# EAGLE design BradLightFlash.rev1 (EAGLE 6.5.0)
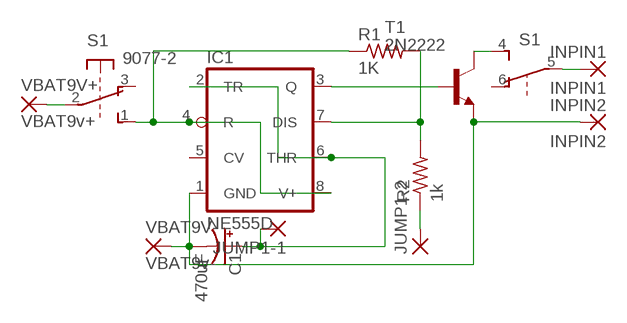
[diagram p0: schematic, sheet 1]

## Parts
C1  470uF  CPOL-USE2.5-6  [E2,5-6]
IC1  NE555D  [SO08]
INPIN1  INPIN1  2,54/1,1  [2,54/1,1]
INPIN2  INPIN2  2,54/1,1  [2,54/1,1]
JUMP1-1  2,54/1,0  [2,54/1,0]
JUMP1-2  2,54/1,0  [2,54/1,0]
R1  1K  R-US_0309/V  [0309V]
R2  1k  R-US_0309/V  [0309V]
S1  9077-2  [9077-2]
T1  2N2222  [TO92-EBC-OVAL]
VBAT9V+  VBAT9v+  2,54/1,1  [2,54/1,1]
VBAT9V-  VBAT9v-  2,54/1,1  [2,54/1,1]

## Nets
N$1: S1.2(1:P) VBAT9V+.1(P)
N$2: IC1.4(R) IC1.8(V+) R1.1 S1.1(1:S)
N$3: C1.- IC1.1(GND) INPIN2.1(P) T1.E VBAT9V-.1(P)
N$4: C1.+ IC1.2(TR) IC1.6(THR) JUMP1-1.1(P)
N$5: JUMP1-2.1(P) R2.1
N$6: IC1.7(DIS) R1.2 R2.2
N$7: IC1.3(Q) T1.B
N$8: S1.4(2:S) T1.C
N$10: INPIN1.1(P) S1.5(2:P)
Unconnected: IC1.5(CV) S1.3(1:O) S1.6(2:O)

## Library data of the parts
C1 = adafruit:CPOL-US: POLARIZED CAPACITOR, American symbol
IC1 = adafruit:*555: TIMER Changed DIP package to have round (not oval) pin pads http://www.ladyada.net/library/pcb/eaglelibrary.html
INPIN1 INPIN2 VBAT9V+ VBAT9V- = wirepad:2,54/1,1: THROUGH-HOLE PAD
JUMP1-1 JUMP1-2 = wirepad:2,54/1,0: THROUGH-HOLE PAD
R1 R2 = adafruit:R-US_: RESISTOR, American symbol
S1 = switch-misc:9077-2: MARQUARDT SWITCH 9077.0200 Distributor: Buerklin <https://www.buerklin.com/default.asp?event=ShowArtikel%2812G2822%29&l=d&jump=ArtNr_12G2822>
T1 = adafruit:2N2222: NPN TRANSISTOR Big oval pads

## Board
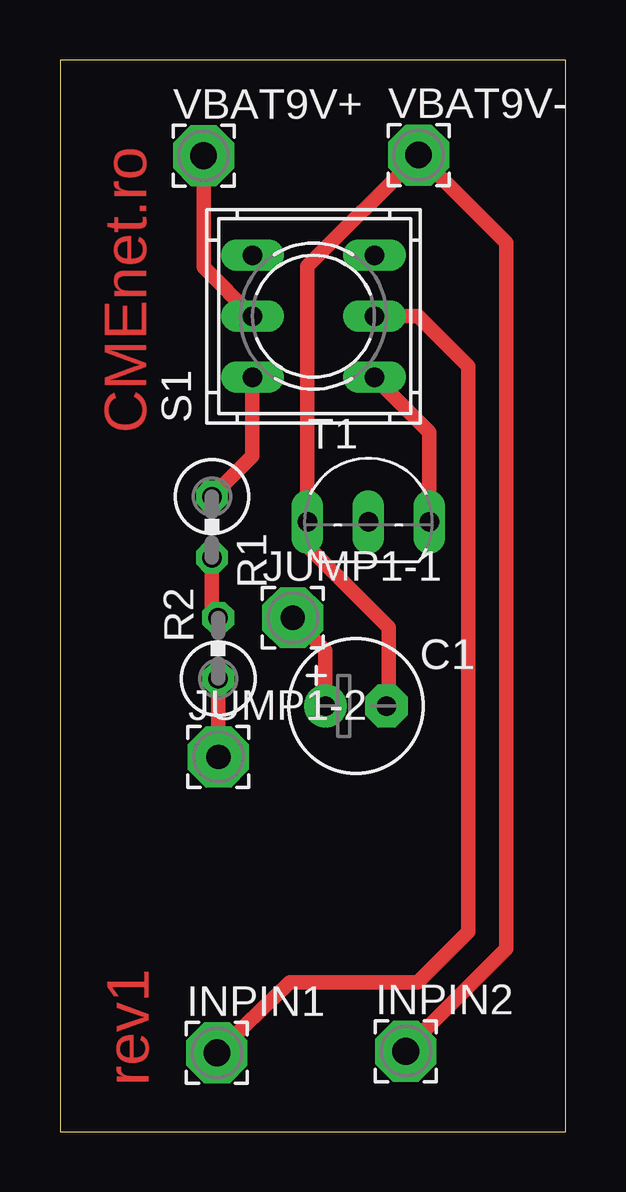
[diagram p1: board, top side]
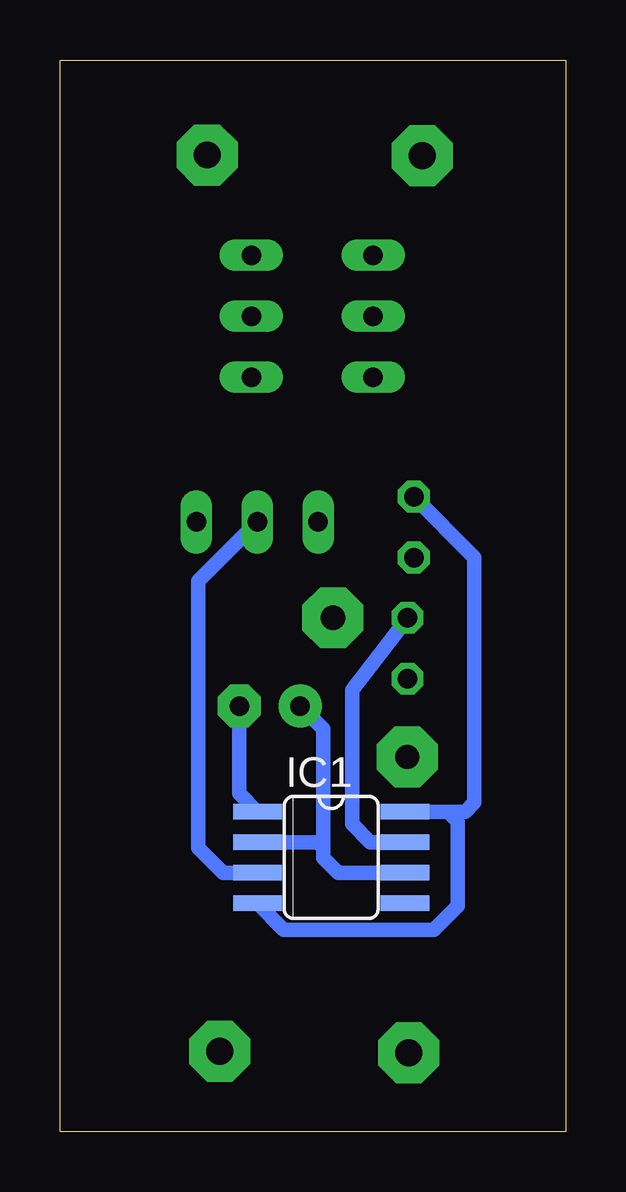
[diagram p2: board, bottom side, seen from below]

Size 21.07 x 44.68 mm. Coordinates in mm from the lower left corner, seen from the top.
Outline: 0,0 21.07,0 21.07,44.68 0,44.68 0,0
Copper layers (1*16): Top 0.035mm / dielectric 1.5mm / Bottom 0.035mm
Design rules "default": minimum track width 10mil, minimum drill 24mil, track to track 8mil, track to pad 8mil, pad to pad 8mil, via to via 8mil, smd to smd 8mil, copper to edge 40mil, drill to drill 8mil, minimum pad ring 10mil, minimum via ring 8mil, stop-mask expansion 4mil, vias tented up to drill 0mil, thermal gap 10mil

### Footprints (pad centres in the part's own frame; a part is rotated, then mirrored left to right if it is on the bottom)
E2,5-6 = drill 0.813 pad 1.778: + -1.27,0 | drill 0.813 pad 1.778 octagon: - 1.27,0
SO08 = smd 0.66 x 2.032: 1 -1.905,-3.073; 2 -0.635,-3.073; 3 0.635,-3.073; 4 1.905,-3.073; 5 1.905,3.073; 6 0.635,3.073; 7 -0.635,3.073; 8 -1.905,3.073
2,54/1,1 = drill 1.118 pad 2.54 octagon: 1 0,0
2,54/1,0 = drill 1.016 pad 2.54 octagon: 1 0,0
0309V = drill 0.813 octagon: 1 -1.27,0; 2 1.27,0
9077-2 = drill 0.813 long: 1 -2.54,2.54; 2 0,2.54; 3 2.54,2.54; 4 -2.54,-2.54; 5 0,-2.54; 6 2.54,-2.54
TO92-EBC-OVAL = drill 0.813 long: B 0,-1.27; C 2.54,-1.27; E -2.54,-1.27

### Placement (x,y rotation side)
C1  12.33,17.75 0 top
IC1  9.77,11.44 270 bottom
INPIN1  6.54,3.29 0 top
INPIN2  14.41,3.36 0 top
JUMP1-1  9.7,21.43 0 top
JUMP1-2  6.6,15.63 0 top
R1  6.33,25.21 270 top
R2  6.59,20.16 90 top
S1  10.56,34 90 top
T1  12.85,26.69 0 top
VBAT9V+  5.98,40.69 0 top
VBAT9V-  14.94,40.72 0 top

### Tracks (layer width: path | path; a pad name or v marks a point on that pad's centre or on a via)
N$1
  Top 0.61: VBAT9V+.1 5.98,36.04 S1.2
N$2
  Top 0.61: S1.1 8.02,28.17 R1.1
  Bottom 0.61: R1.1 3.8,23.95 3.8,13.73 4.18,13.34 4.9,13.34 | 4.9,13.34 IC1.8 | IC1.4 11.74,8.43 5.5,8.43 4.5,9.43 4.5,12.94 4.9,13.34
N$3
  Top 0.61: C1.- 13.7,17.85 13.7,21.03 10.31,24.42 T1.E 10.31,36.09 VBAT9V-.1 18.6,37.06 18.6,7.63 14.43,3.46 INPIN2.1
  Bottom 0.61: C1.- 13.6,14.1 IC1.1
N$4
  Top 0.61: JUMP1-1.1 11.06,20.07 C1.+
  Bottom 0.61: C1.+ 10.1,16.79 10.1,11.83 | 10.1,11.83 10.1,11.43 9.47,10.8 IC1.6 | IC1.2 10.35,12.07 10.1,11.83
N$5
  Top 0.61: R2.1 6.6,18.18 JUMP1-2.1
N$6
  Top 0.61: R1.2 6.33,21.69 R2.2
  Bottom 0.61: R2.2 8.9,18.42 8.9,12.83 8.14,12.07 IC1.7
N$7
  Bottom 0.61: T1.B 15.3,22.97 15.3,11.83 14.28,10.8 IC1.3
N$8
  Top 0.61: S1.4 15.39,29.17 T1.C
N$10
  Top 0.61: INPIN1.1 9.58,6.23 14.9,6.23 17,8.33 17,31.93 14.93,34 S1.5

### Text on the board
Top: CMEnet.ro | rev1
_tNames: VBAT9V+ | VBAT9V- | S1 | T1 | R1 | JUMP1-1 | R2 | C1 | JUMP1-2 | INPIN1 | INPIN2
_bNames: IC1
_tValues: INPIN1 | INPIN2